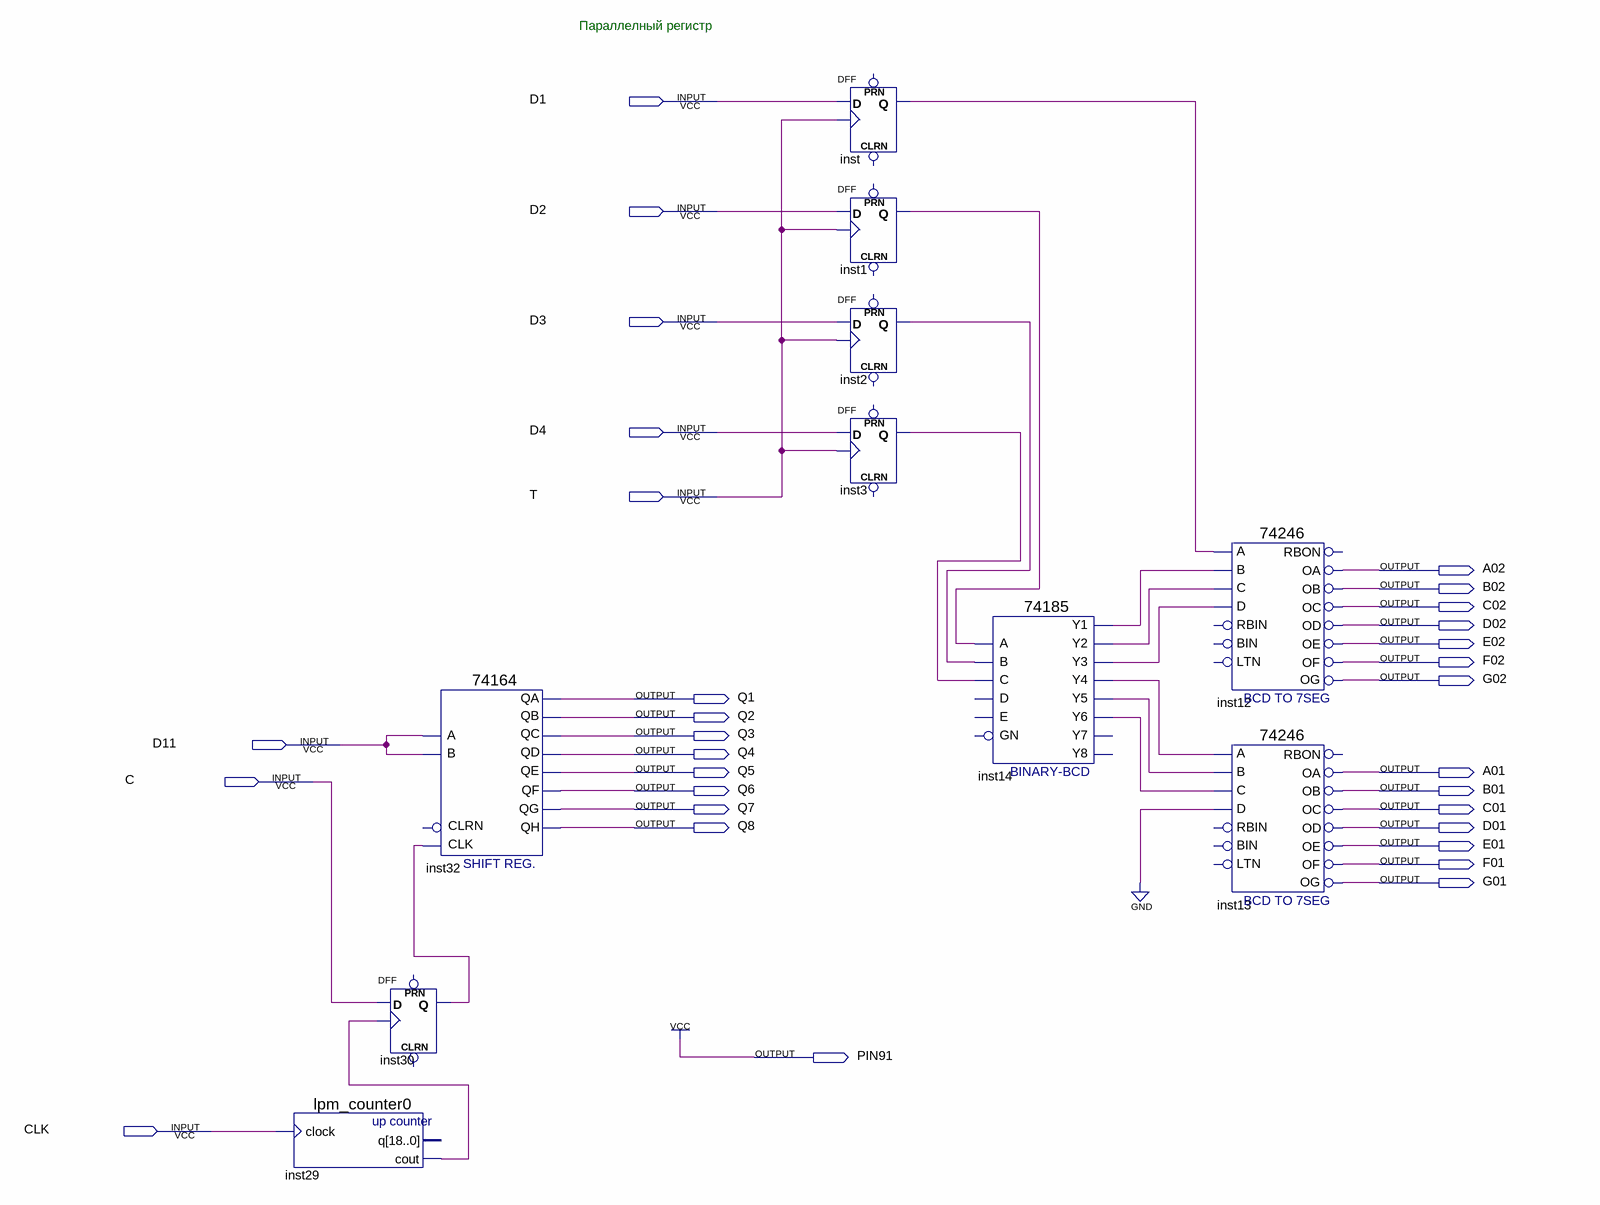
[diagram p0: schematic sheet]
// Quartus schematic Registers.bdf as structural Verilog: 10 symbols, 31 pins
module Registers (
  input  D1,
  input  D2,
  input  D3,
  input  D4,
  input  T,
  input  D11,
  input  C,
  input  CLK,
  output A02,
  output B02,
  output C02,
  output D02,
  output E02,
  output F02,
  output G02,
  output Q1,
  output Q2,
  output Q3,
  output Q4,
  output Q5,
  output A01,
  output Q6,
  output B01,
  output Q7,
  output C01,
  output Q8,
  output D01,
  output E01,
  output F01,
  output G01,
  output PIN91
);

  wire inst1_q, inst2_q, inst3_q, inst14_y1, inst14_y2, inst14_y3, inst14_y4, inst14_y5, inst14_y6,
       inst29_cout, inst30_q, inst_q;

  lpm_counter0 inst29 (.clock(CLK), .cout(inst29_cout));  // open: q
  \74164  inst32 (
    .CLK(inst30_q), .B(D11), .A(D11), .QD(Q4), .QC(Q3), .QA(Q1), .QF(Q6), .QH(Q8), .QG(Q7), .QE(Q5), .QB(Q2));  // open: CLRN
  DFF inst30 (.CLK(inst29_cout), .D(C), .Q(inst30_q));  // open: CLRN, PRN
  DFF inst (.CLK(T), .D(D1), .Q(inst_q));  // open: CLRN, PRN
  DFF inst1 (.CLK(T), .D(D2), .Q(inst1_q));  // open: CLRN, PRN
  DFF inst2 (.CLK(T), .D(D3), .Q(inst2_q));  // open: CLRN, PRN
  DFF inst3 (.CLK(T), .D(D4), .Q(inst3_q));  // open: CLRN, PRN
  \74185  inst14 (
    .A(inst1_q), .B(inst2_q), .C(inst3_q), .Y1(inst14_y1), .Y3(inst14_y3), .Y2(inst14_y2), .Y5(inst14_y5),
    .Y4(inst14_y4), .Y6(inst14_y6));  // open: D, E, GN, Y8, Y7
  \74246  inst12 (
    .B(inst14_y1), .A(inst_q), .D(inst14_y3), .C(inst14_y2), .OD(D02), .OC(C02), .OB(B02), .OE(E02),
    .OF(F02), .OA(A02), .OG(G02));  // open: RBIN, LTN, BIN, RBON
  \74246  inst13 (
    .B(inst14_y5), .A(inst14_y4), .D(1'b0), .C(inst14_y6), .OD(D01), .OC(C01), .OB(B01), .OE(E01), .OF(F01),
    .OA(A01), .OG(G01));  // open: RBIN, LTN, BIN, RBON

  assign PIN91 = 1'b1;

  // Notes on the sheet:
  //   Параллелный регистр
endmodule
